# EAGLE schematic PCB0M8B3 (EAGLE 6.2)

## Sheet 1 of 3
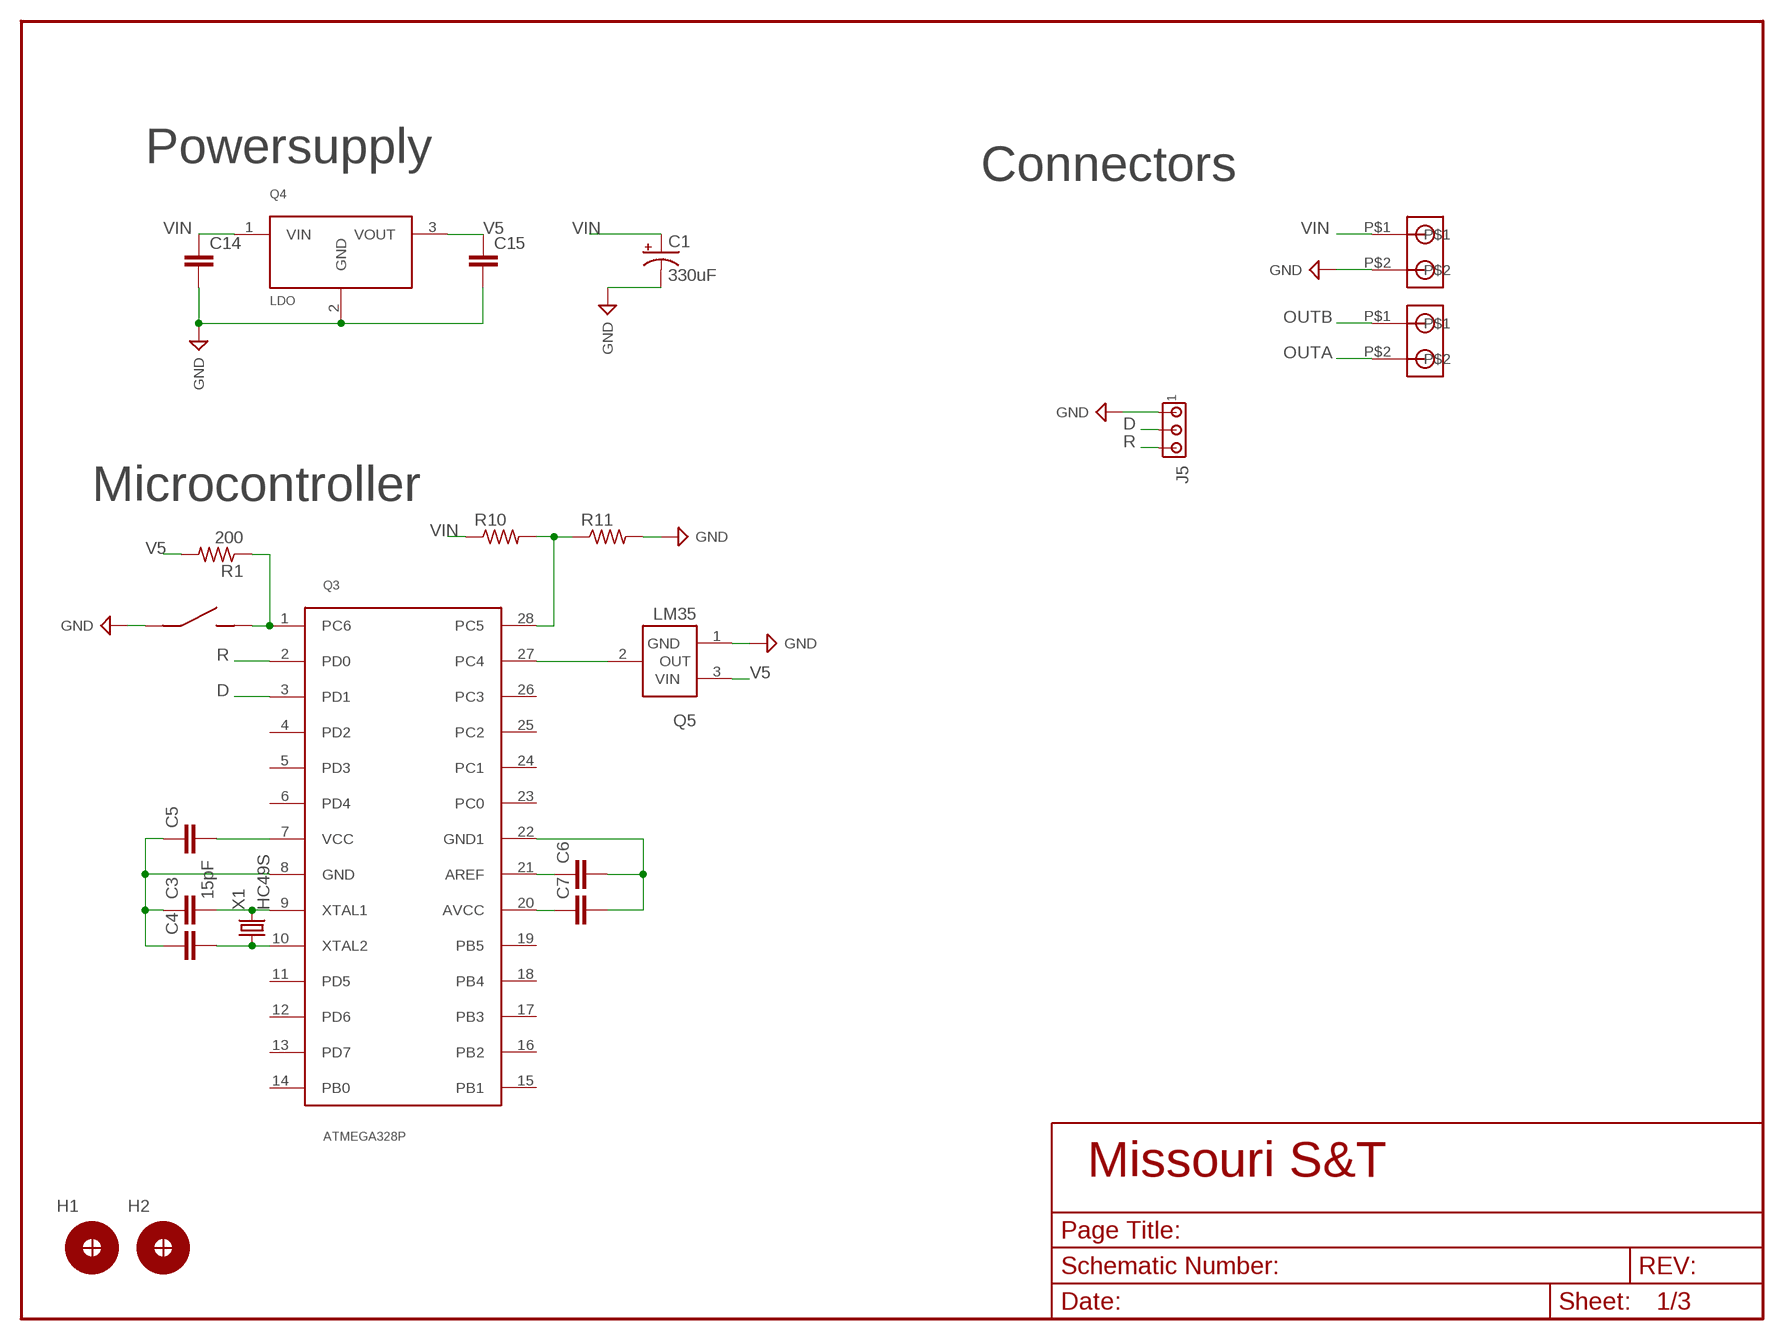
[diagram p0: schematic, sheet 1]

### Parts
C1  330uF  C_POL8MM  [C_8MM]
C3  15pF  C_CAP_0805  [C_0805]
C4  C_CAP_0805  [C_0805]
C5  C_CAP_0805  [C_0805]
C6  C_CAP_0805  [C_0805]
C7  C_CAP_0805  [C_0805]
C14  C_CAP_0805  [C_0805]
C15  C_CAP_0805  [C_0805]
H1  H_MNTHOLE_#4  [H_MNTHOLE_#4]
H2  H_MNTHOLE_#4  [H_MNTHOLE_#4]
J1  J_1546074-2282834-2  [J_2.54MM]
J2  J_1546074-2282834-2  [J_2.54MM]
J4  J_MC32857  [J_TOGGLE]
J5  J_MTA3P_100  [J_MTA100_3P]
Q3  ATMEGA328P  Q_ATMEGA328P  [DIP28]
Q4  LDO  Q_LDO  [TO-220]
Q5  LM35  Q_LM35  [TO-92-3]
R1  200  R_RES_0805  [R_0805]
R10  R_RES_0805  [R_0805]
R11  R_RES_0805  [R_0805]
X1  HC49S  X_HC49SCRYSTAL  [HC-49]

### Nets
D: J5.2 Q3.3(PD1)
GND: C1.- C3.1 C4.1 C5.1 C6.2 C7.2 C14.2 C15.2 J1.P$2 J4.P$1 J5.1 Q3.8(GND) Q3.22(GND1) Q4.2(GND) Q5.1(GND) R11.2 ; supply symbol labelled SUP_GND ; also sheet 2,3
N$1: C4.2 Q3.10(XTAL2) X1.P$1
N$2: C3.2 Q3.9(XTAL1) X1.P$2
N$4: Q3.27(PC4) Q5.2(OUT)
N$5: Q3.28(PC5) R10.2 R11.1
N$6: C6.1 Q3.21(AREF)
N$8: J4.P$2 Q3.1(PC6) R1.1
OUTA: J2.P$2
OUTB: J2.P$1 ; also sheet 2
R: J5.3 Q3.2(PD0)
V5: C5.2 C7.1 C15.1 Q3.7(VCC) Q3.20(AVCC) Q4.3(VOUT) Q5.3(VIN) R1.2 ; also sheet 2
VIN: C1.+ C14.1 J1.P$1 Q4.1(VIN) R10.1 ; also sheet 2
Unconnected: H1.1 H2.1 Q3.4(PD2) Q3.5(PD3) Q3.6(PD4) Q3.11(PD5) Q3.12(PD6) Q3.13(PD7) Q3.14(PB0) Q3.15(PB1) Q3.16(PB2) Q3.17(PB3) Q3.18(PB4) Q3.19(PB5) Q3.23(PC0) Q3.24(PC1) Q3.25(PC2) Q3.26(PC3)

### Notes on the sheet
- Powersupply
- Connectors
- Microcontroller

## Sheet 2 of 3
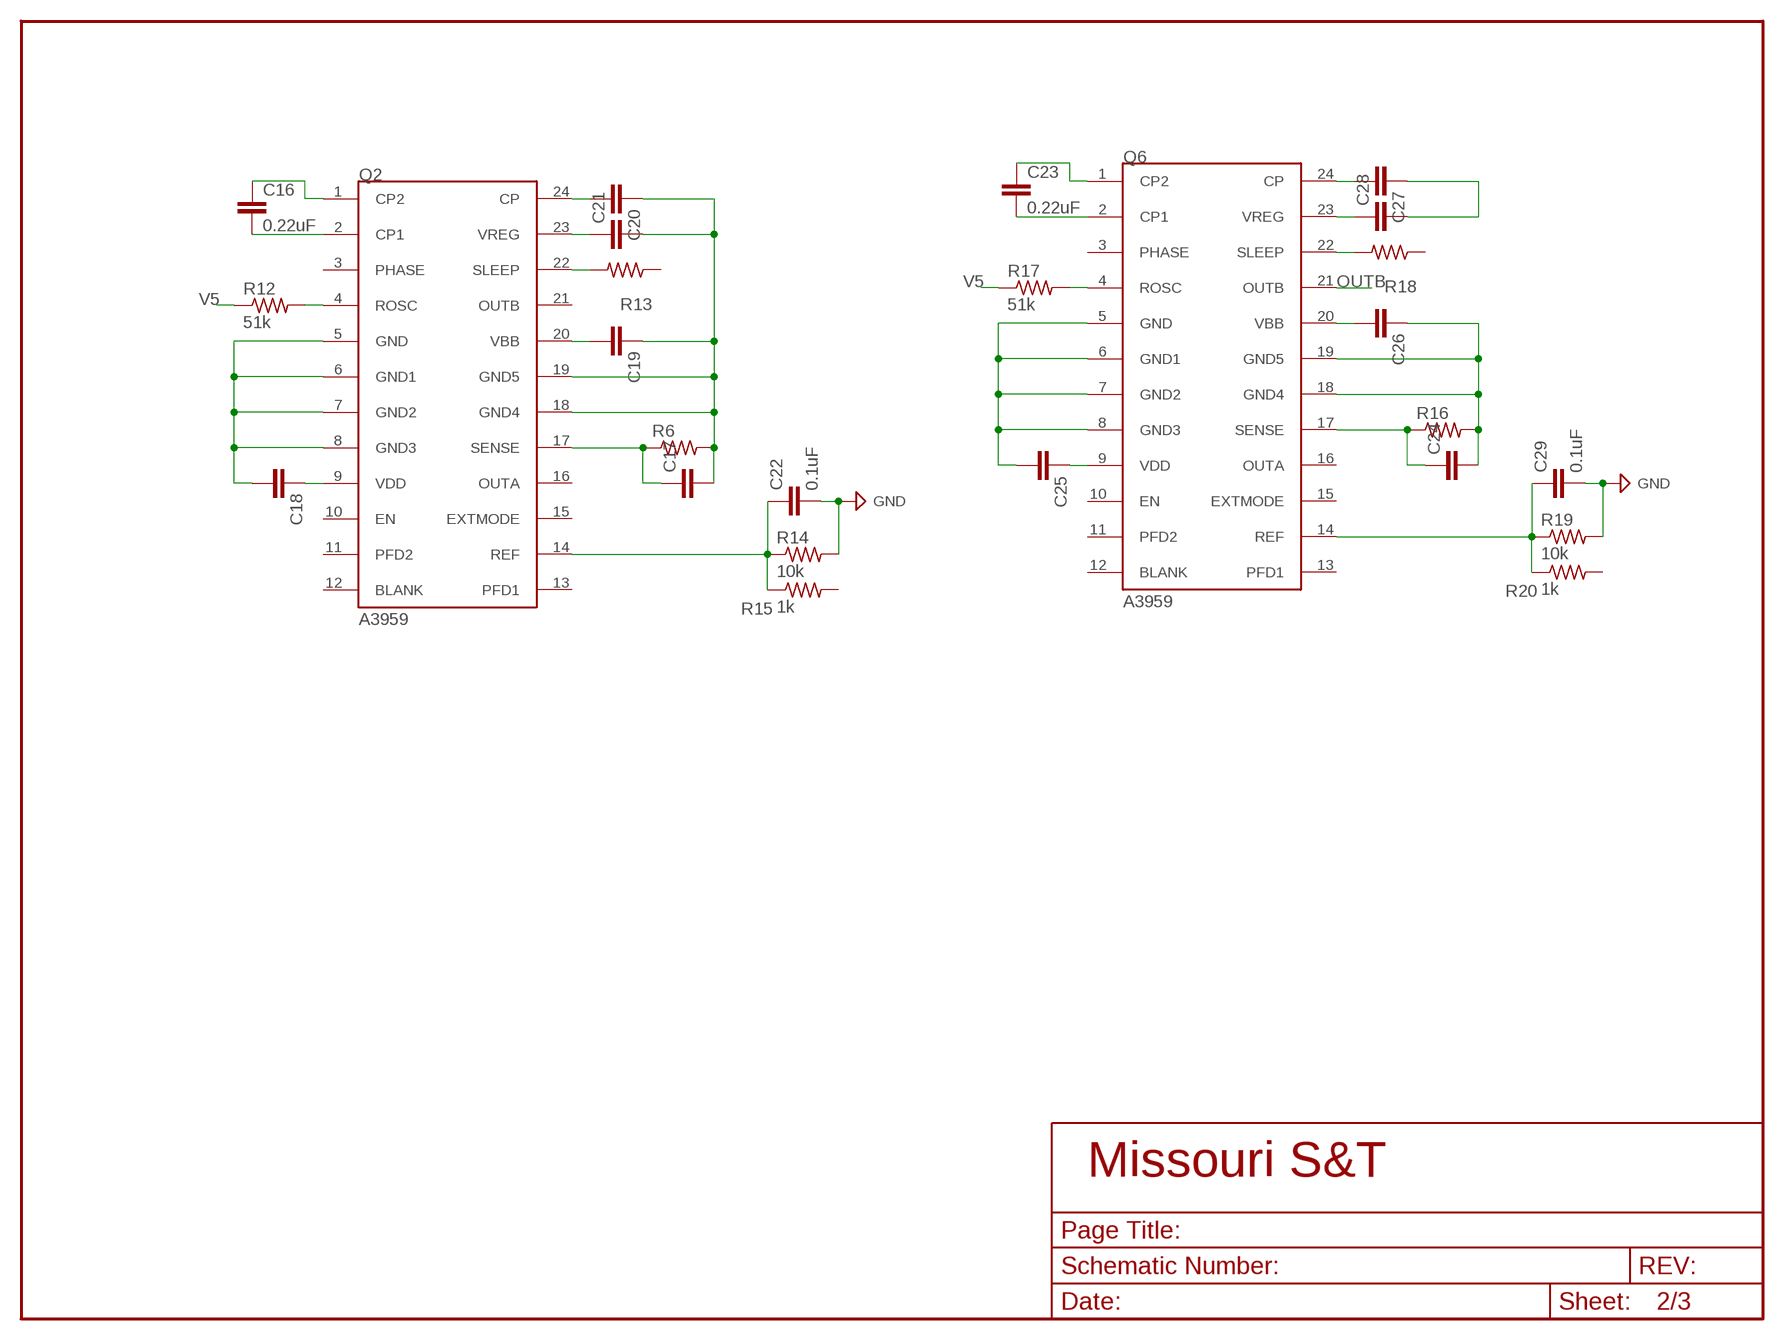
[diagram p1: schematic, sheet 2]

### Parts
C16  0.22uF  C_CAP_0805  [C_0805]
C17  C_CAP_0805  [C_0805]
C18  C_CAP_0805  [C_0805]
C19  C_CAP_0805  [C_0805]
C20  C_CAP_0805  [C_0805]
C21  C_CAP_0805  [C_0805]
C22  0.1uF  C_CAP_0805  [C_0805]
C23  0.22uF  C_CAP_0805  [C_0805]
C24  C_CAP_0805  [C_0805]
C25  C_CAP_0805  [C_0805]
C26  C_CAP_0805  [C_0805]
C27  C_CAP_0805  [C_0805]
C28  C_CAP_0805  [C_0805]
C29  0.1uF  C_CAP_0805  [C_0805]
Q2  A3959  Q_A3959  [DIP24]
Q6  A3959  Q_A3959  [DIP24]
R6  R_RES_2010  [R_2010]
R12  51k  R_RES_0805  [R_0805]
R13  R_1/4WL  [R_1/4WL]
R14  10k  R_RES_0805  [R_0805]
R15  1k  R_RES_0805  [R_0805]
R16  R_RES_2010  [R_2010]
R17  51k  R_RES_0805  [R_0805]
R18  R_1/4WL  [R_1/4WL]
R19  10k  R_RES_0805  [R_0805]
R20  1k  R_RES_0805  [R_0805]

### Nets
GND: C17.2 C18.2 C19.1 C20.1 C21.2 C22.2 C24.2 C25.2 C26.1 C29.2 Q2.5(GND) Q2.6(GND1) Q2.7(GND2) Q2.8(GND3) Q2.18(GND4) Q2.19(GND5) Q6.5(GND) Q6.6(GND1) Q6.7(GND2) Q6.8(GND3) Q6.18(GND4) Q6.19(GND5) R6.2 R14.2 R16.2 R19.2 ; supply symbol labelled SUP_GND ; also sheet 1,3
ISENSE: C17.1 C24.1 Q2.17(SENSE) Q6.17(SENSE) R6.1 R16.1
N$11: C16.1 Q2.1(CP2)
N$12: C16.2 Q2.2(CP1)
N$14: Q2.4(ROSC) R12.2
N$15: C20.2 Q2.24(CP)
N$16: C21.1 Q2.23(VREG)
N$17: Q2.22(SLEEP) R13.2
N$18: C23.1 Q6.1(CP2)
N$20: C23.2 Q6.2(CP1)
N$22: Q6.4(ROSC) R17.2
N$23: C27.2 Q6.24(CP)
N$24: C28.1 Q6.23(VREG)
N$25: Q6.22(SLEEP) R18.2
N$26: C27.1 C28.2
OUTB: Q6.21(OUTB) ; also sheet 1
REF2: C22.1 Q2.14(REF) R14.1 R15.1
REF3: C29.1 Q6.14(REF) R19.1 R20.1
V5: C18.1 C25.1 Q2.9(VDD) Q6.9(VDD) R12.1 R17.1 ; also sheet 1
VIN: C19.2 C26.2 Q2.20(VBB) Q6.20(VBB) ; also sheet 1
Unconnected: Q2.3(PHASE) Q2.10(EN) Q2.11(PFD2) Q2.12(BLANK) Q2.13(PFD1) Q2.15(EXTMODE) Q2.16(OUTA) Q2.21(OUTB) Q6.3(PHASE) Q6.10(EN) Q6.11(PFD2) Q6.12(BLANK) Q6.13(PFD1) Q6.15(EXTMODE) Q6.16(OUTA) R13.1 R15.2 R18.1 R20.2

## Sheet 3 of 3
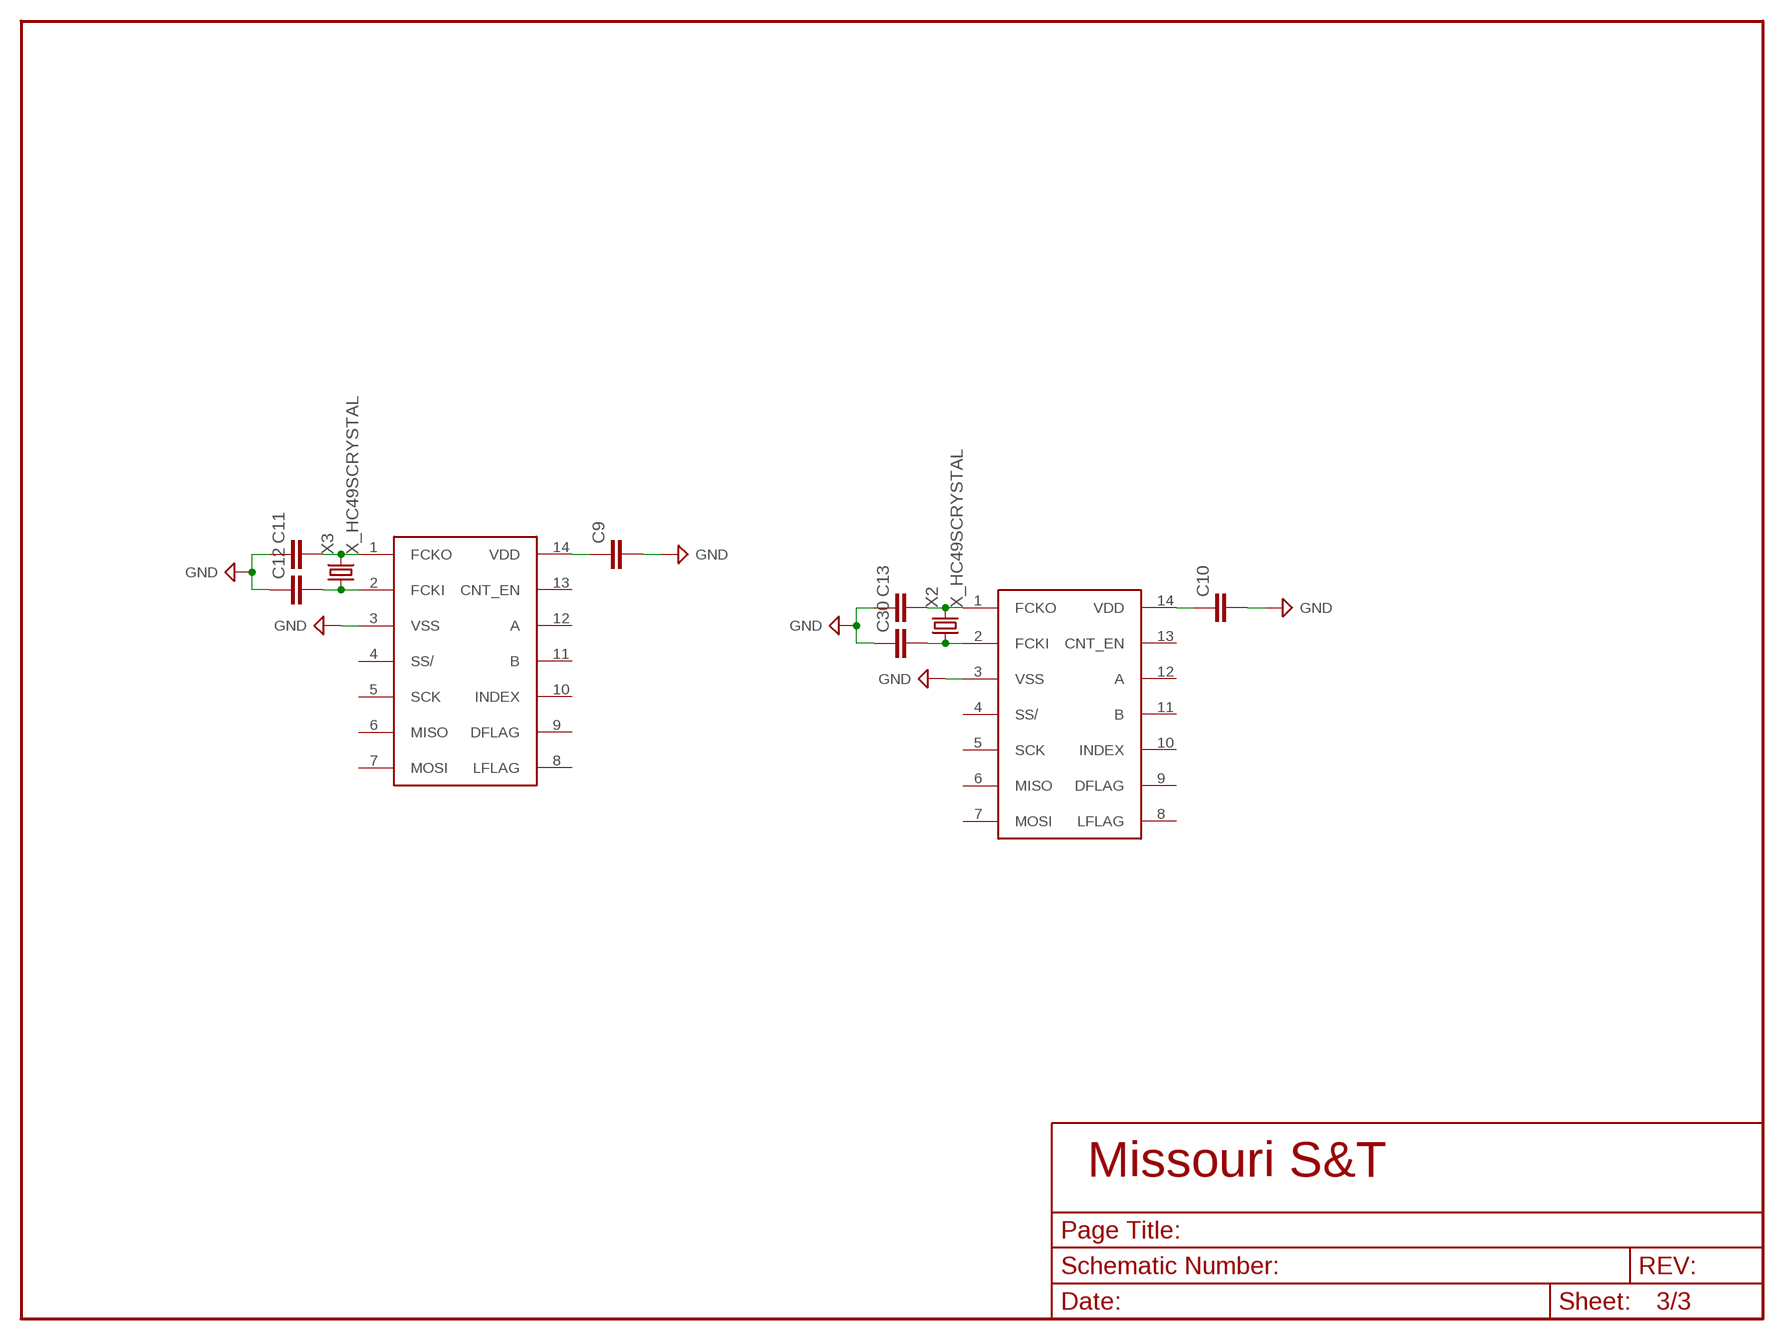
[diagram p2: schematic, sheet 3]

### Parts
C9  C_CAP_1206  [C_1206]
C10  C_CAP_0805  [C_0805]
C11  C_CAP_0805  [C_0805]
C12  C_CAP_0805  [C_0805]
C13  C_CAP_0805  [C_0805]
C30  C_CAP_0805  [C_0805]
Q8  Q_LFLS7366R-S  [SOIC14]
Q9  Q_LFLS7366R-S  [SOIC14]
X2  X_HC49SCRYSTAL  [HC-49]
X3  X_HC49SCRYSTAL  [HC-49]

### Nets
GND: C9.2 C10.2 C11.1 C12.1 C13.1 C30.1 Q8.3(VSS) Q9.3(VSS) ; supply symbol labelled SUP_GND ; also sheet 1,2
N$3: C9.1 Q8.14(VDD)
N$9: C10.1 Q9.14(VDD)
N$10: C12.2 Q8.2(FCKI) X3.P$1
N$13: C11.2 Q8.1(FCKO) X3.P$2
N$19: C13.2 Q9.1(FCKO) X2.P$2
N$21: C30.2 Q9.2(FCKI) X2.P$1
Unconnected: Q8.4(SS/) Q8.5(SCK) Q8.6(MISO) Q8.7(MOSI) Q8.8(LFLAG) Q8.9(DFLAG) Q8.10(INDEX) Q8.11(B) Q8.12(A) Q8.13(CNT_EN) Q9.4(SS/) Q9.5(SCK) Q9.6(MISO) Q9.7(MOSI) Q9.8(LFLAG) Q9.9(DFLAG) Q9.10(INDEX) Q9.11(B) Q9.12(A) Q9.13(CNT_EN)

## Library data of the parts
C1 = PCB0M1:C_POL: Alum Elect. Cap with 10mm diameter, 5mm lead spacing and 0.7mm lead diameter
C3-C7 C9-C30 = Lib_Passive:C_CAP
H1 H2 = Lib_TH:H_MNTHOLE
J1 J2 = PCB0M1:J_1546074-2
J4 = PCB0M1:J_MC32857: SWITCH, TACTILE, SPST-NO, 50mA, THD
J5 = Lib_TH:J_MTA3P
Q2 Q6 = PCB0M1:Q_A3959: Full Bridge Peak Current mode controll driver
Q3 = PCB0M1:Q_ATMEGA328P: ATMEGA 328P in 28PIN PDIP package
Q4 = PCB0M1:Q_LDO: LDO with fixed ouput voltage
Q5 = PCB0M1:Q_LM35: IC, TEMPERATURE SENSOR, 0.4°C, TO-92-3
Q8 Q9 = PCB0M1:Q_LFLS7366R-S
R1 R6 R10-R12 R14-R17 R19 R20 = Lib_Passive:R_RES
R13 R18 = PCB0M1:R_1/4WL: Standard 1/4W resistor package that has long leads to bridge traces
X1-X3 = PCB0M1:X_HC49SCRYSTAL: CRYSTAL METAL CAN, 16MHZ, 18PF, HC-49/US